# EAGLE schematic line_kick (EAGLE 9.5.1)
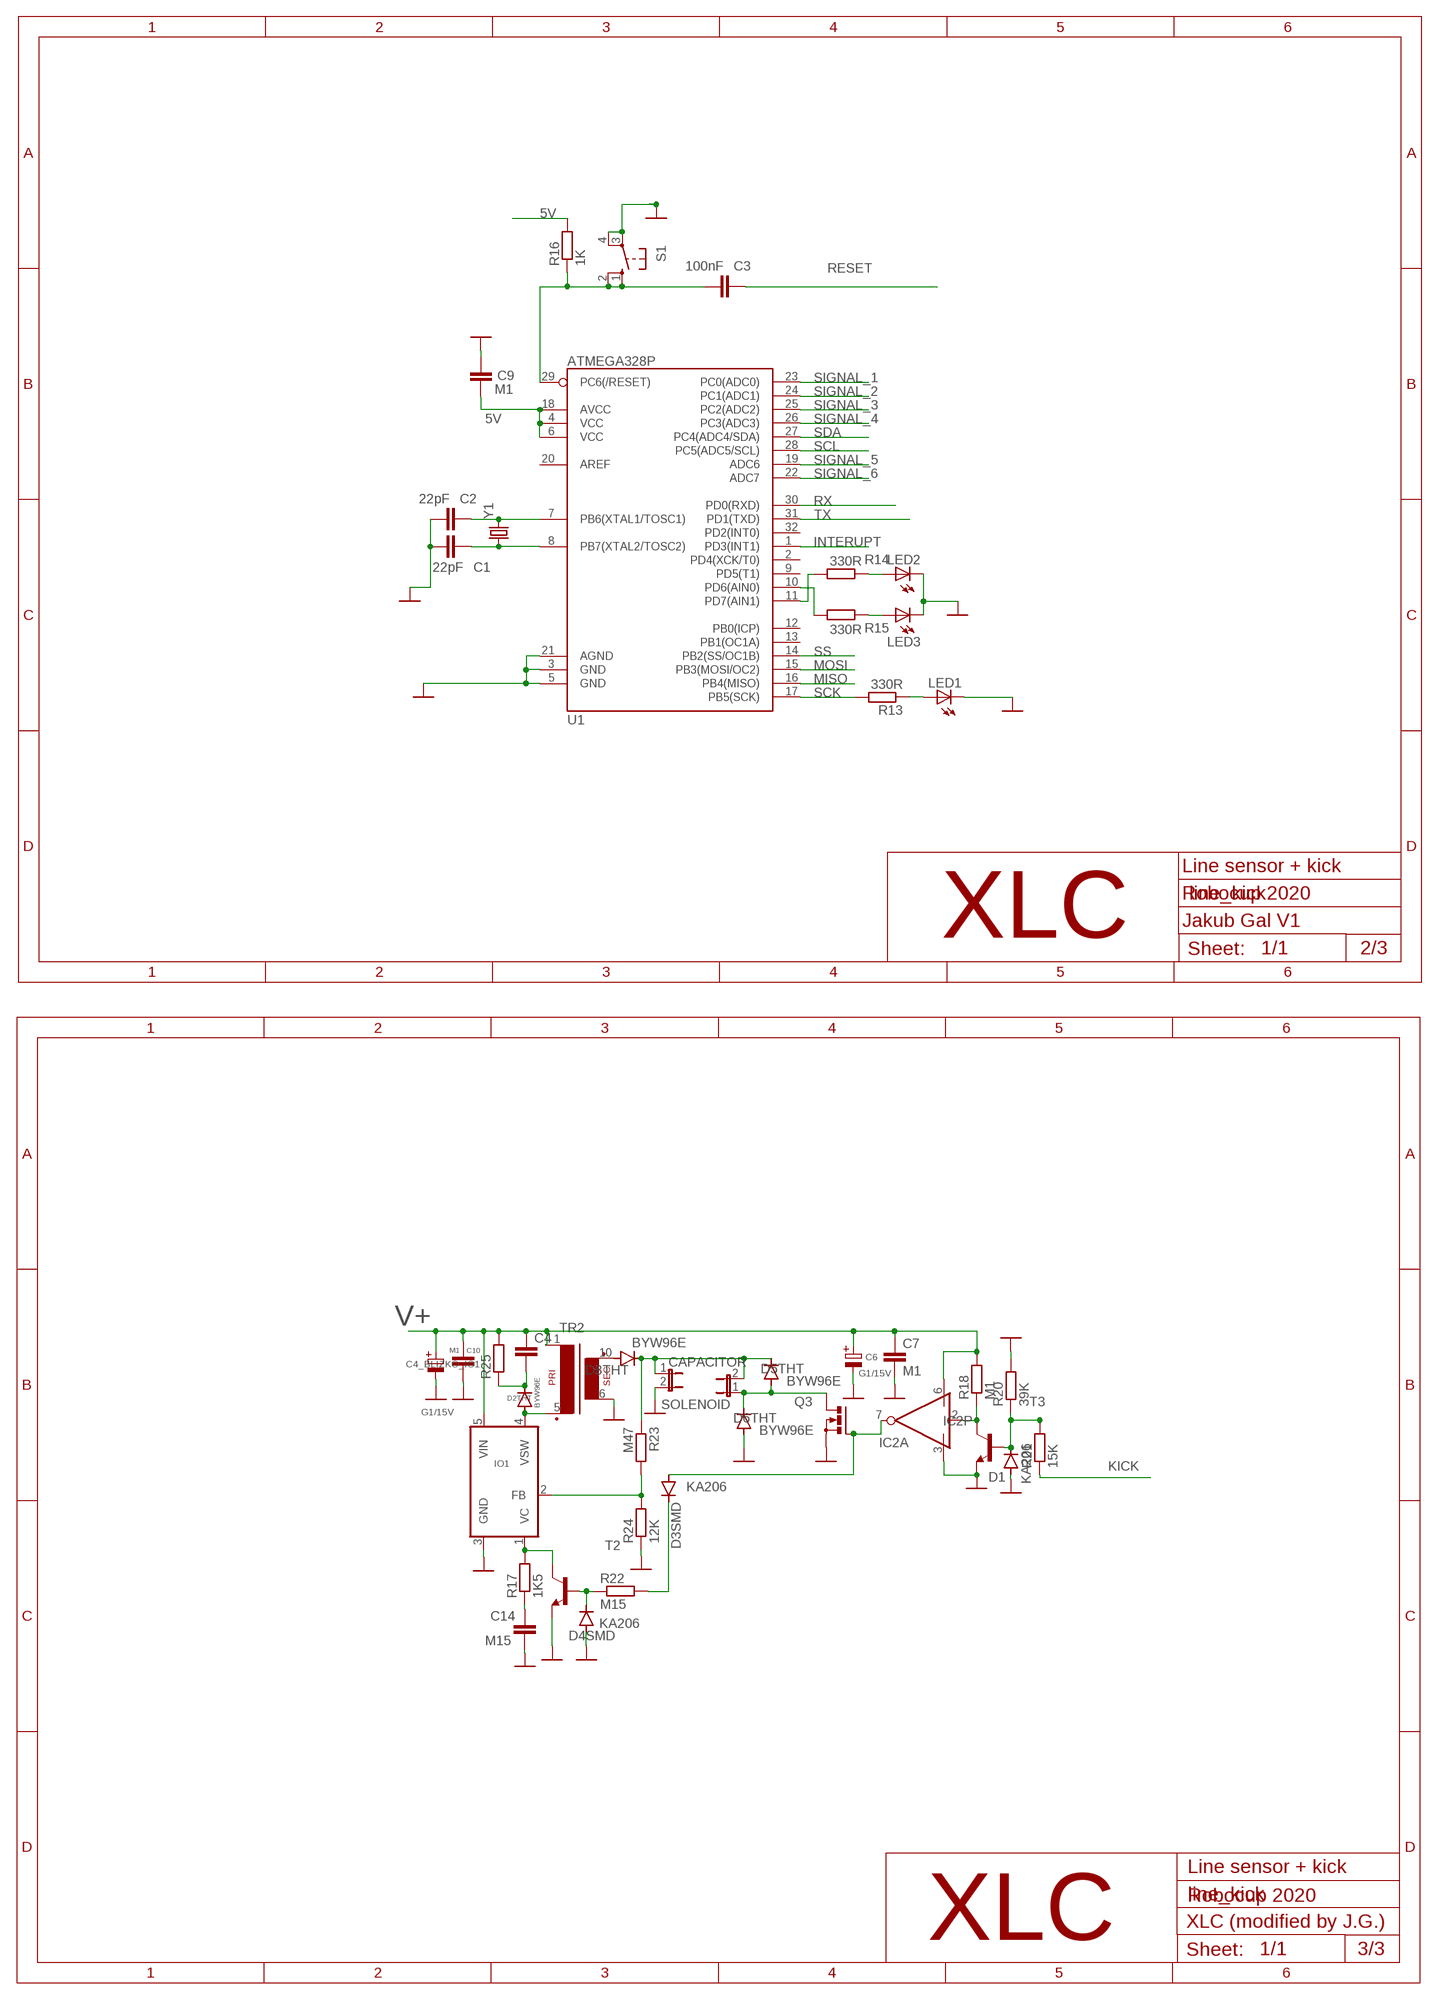
[diagram p0: schematic, sheet 1, part 1 of 2]
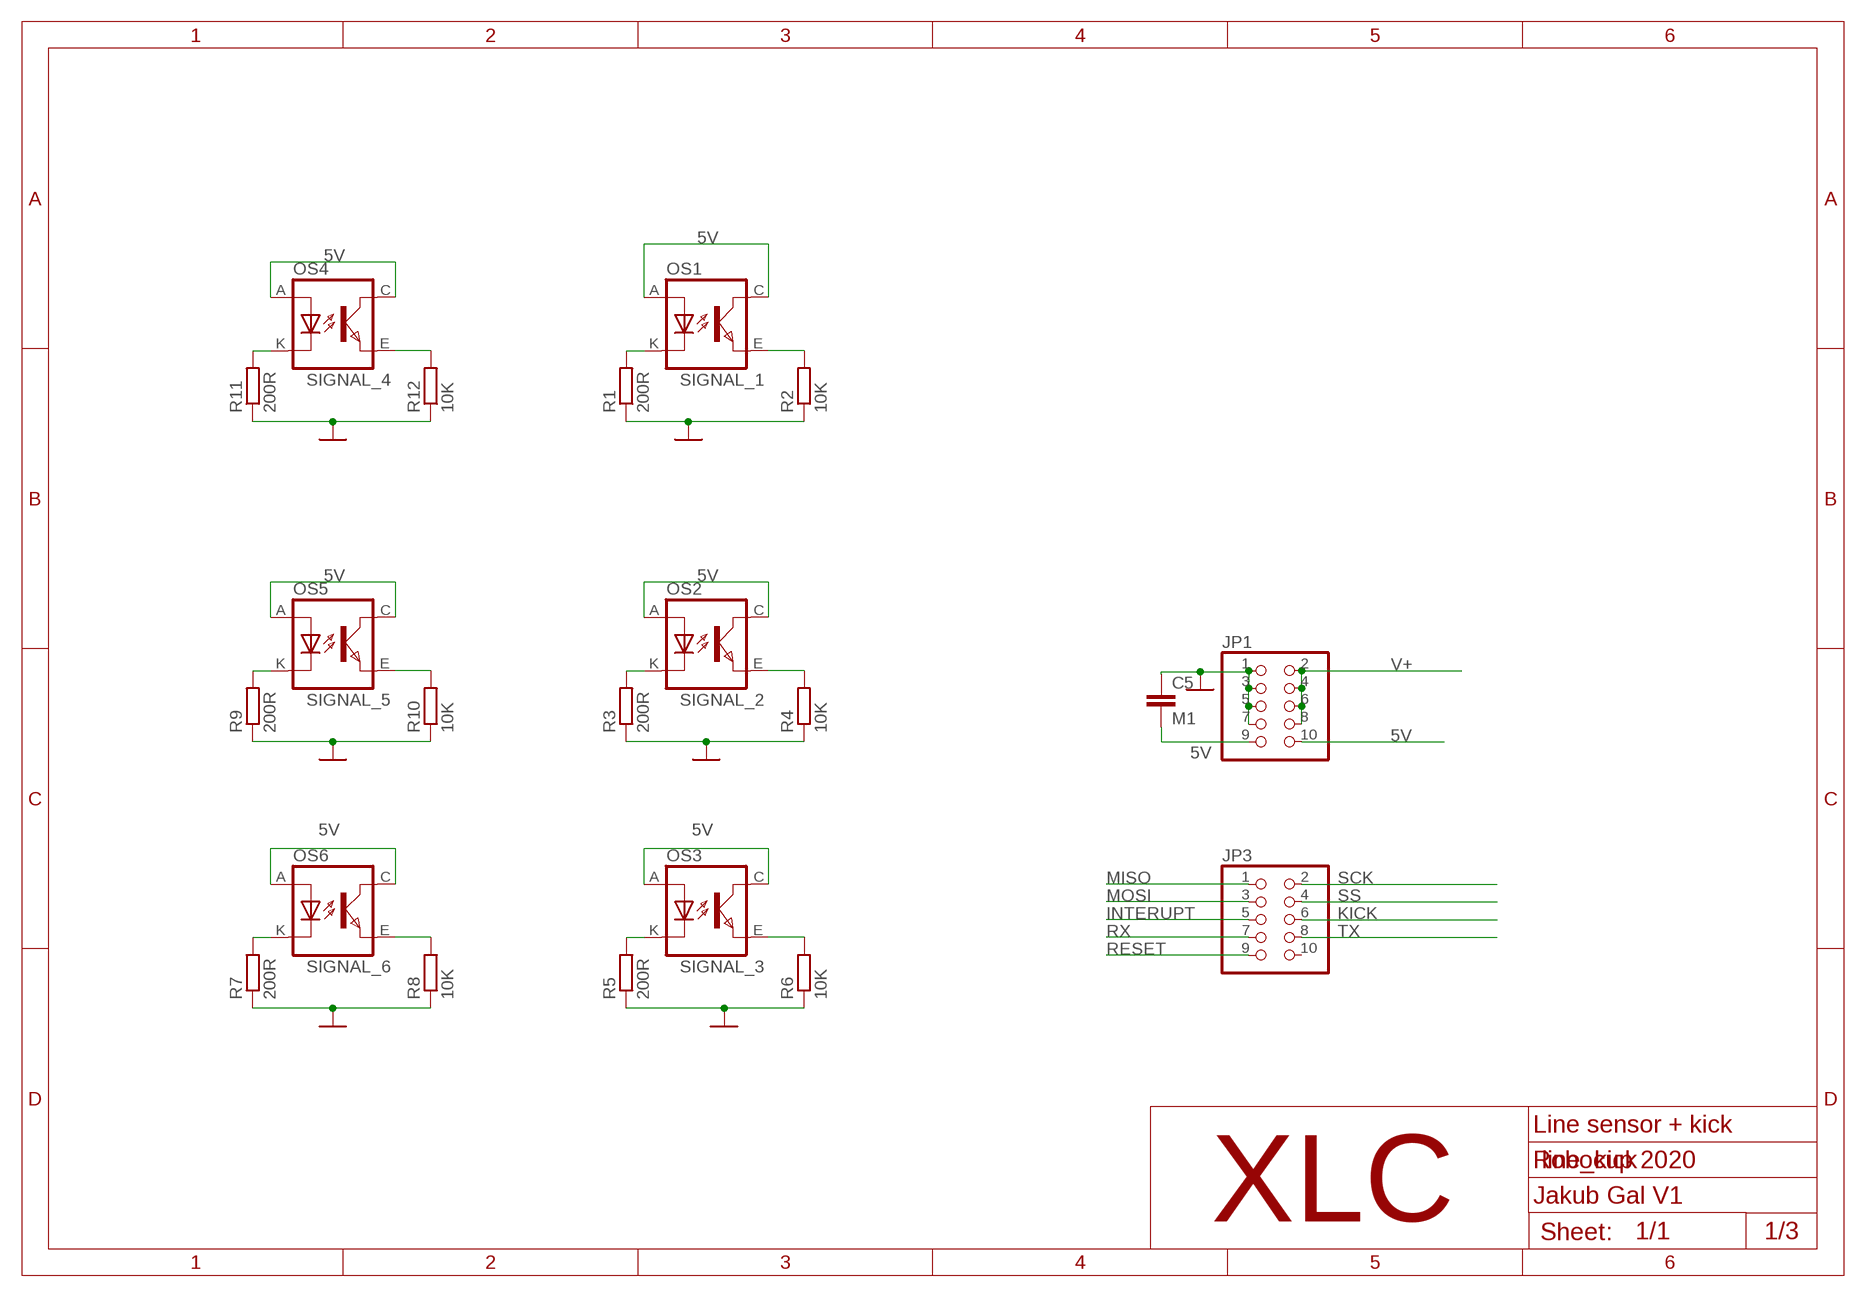
[diagram p1: schematic, sheet 1, part 2 of 2]

## Parts
C1  22pF  C-EUC0603  [C0603]
C2  22pF  C-EUC0603  [C0603]
C3  100nF  C-EUC0603  [C0603]
C4  C-EU075-052X106  [C075-052X106]
C4_BLIZKO_IO1  G1/15V  KOND-ELEKT-2,5/7  [E-2,5/7-RAD]
C5  M1  C-EUC0603  [C0603]
C6  G1/15V  KOND-ELEKT-2,5/7  [E-2,5/7-RAD]
C7  M1  C-EUC0805K  [C0805K]
C9  M1  C-EUC0603  [C0603]
C10  M1  C-EUC0805K  [C0805K]
C14  M15  C-EUC0805K  [C0805K]
CAPACITOR  JP1E  [JP1]
D1  KA206  DIODE-D-7.5  [D-7.5]
D2THT  BYW96E  BYW96  [SOD64-10]
D3SMD  KA206  DIODE-D-7.5  [D-7.5]
D4SMD  KA206  DIODE-D-7.5  [D-7.5]
D5THT  BYW96E  BYW96  [SOD64-10]
D6THT  BYW96E  BYW96  [SOD64-10]
D8THT  BYW96E  BYW96  [SOD64-10]
IC2  MIC4423BM  [SO08]
IO1  LT1071V  [TO220-5P]
JP1  PINHD-2X5IDC  [2X05_IDC]
JP3  PINHD-2X5IDC  [2X05_IDC]
LED1  LEDCHIPLED_0603  [CHIPLED_0603]
LED2  LEDCHIPLED_0603  [CHIPLED_0603]
LED3  LEDCHIPLED_0603  [CHIPLED_0603]
OS1  TCRT5000  [TCRT5000]
OS2  TCRT5000  [TCRT5000]
OS3  TCRT5000  [TCRT5000]
OS4  TCRT5000  [TCRT5000]
OS5  TCRT5000  [TCRT5000]
OS6  TCRT5000  [TCRT5000]
Q3  PMOSFET_NTO220BV  [TO220BV]
R1  200R  R-EU_R0603  [R0603]
R2  10K  R-EU_R0603  [R0603]
R3  200R  R-EU_R0603  [R0603]
R4  10K  R-EU_R0603  [R0603]
R5  200R  R-EU_R0603  [R0603]
R6  10K  R-EU_R0603  [R0603]
R7  200R  R-EU_R0603  [R0603]
R8  10K  R-EU_R0603  [R0603]
R9  200R  R-EU_R0603  [R0603]
R10  10K  R-EU_R0603  [R0603]
R11  200R  R-EU_R0603  [R0603]
R12  10K  R-EU_R0603  [R0603]
R13  330R  R-EU_R0603  [R0603]
R14  330R  R-EU_R0603  [R0603]
R15  330R  R-EU_R0603  [R0603]
R16  1K  R-EU_R0603  [R0603]
R17  1K5  R-EU_R1206  [R1206]
R18  M1  R-EU_R1206  [R1206]
R20  39K  R-EU_R1206  [R1206]
R21  15K  R-EU_R1206  [R1206]
R22  M15  R-EU_R1206  [R1206]
R23  M47  R-EU_R1206  [R1206]
R24  12K  R-EU_R1206  [R1206]
R25  REZISTOR-7,5MM-HORIZ  [R-7,5H]
S1  10-XX  [B3F-10XX]
SOLENOID  JP1E  [JP1]
T2  -NPN-SC59-BEC  [SC59-BEC]
T3  -NPN-SC59-BEC  [SC59-BEC]
TR2  TRAFO-E10-R""  [TRAFO-EE17X20]
U1  ATMEGA328P  ATMEGA328_SMT  [TQFP32-08]
Y1  CRYSTALHC49US  [HC49US]

## Nets
5V: C5.2 C9.1 JP1.9 JP1.10 OS1.A(ANODE) OS1.C(COLLECTOR) OS2.A(ANODE) OS2.C(COLLECTOR) OS3.A(ANODE) OS3.C(COLLECTOR) OS4.A(ANODE) OS4.C(COLLECTOR) OS5.A(ANODE) OS5.C(COLLECTOR) OS6.A(ANODE) OS6.C(COLLECTOR) R16.2 U1.4(VCC) U1.6(VCC) U1.18(AVCC)
GND: C1.1 C2.1 C4_BLIZKO_IO1.- C5.1 C6.- C7.2 C9.2 C10.2 C14.2 CAPACITOR.2 D1.A D4SMD.A D6THT.A IC2.3(P:GND) IO1.3(GND) JP1.1 JP1.3 JP1.5 JP1.7 LED1.C LED2.C LED3.C Q3.S R1.1 R2.1 R3.1 R4.1 R5.1 R6.1 R7.1 R8.1 R9.1 R10.1 R11.1 R12.1 R20.2 R24.1 S1.3(P) S1.4(P1) T2.E T3.E TR2.6 U1.3(GND) U1.5(GND) U1.21(AGND)
INTERUPT: JP3.5 U1.1(PD3(INT1))
KICK: JP3.6 R21.1
MISO: JP3.1 U1.16(PB4(MISO))
MOSI: JP3.3 U1.15(PB3(MOSI/OC2))
N$1: OS1.K(CATHODE) R1.2
N$2: OS2.K(CATHODE) R3.2
N$3: OS3.K(CATHODE) R5.2
N$4: OS6.K(CATHODE) R7.2
N$5: OS5.K(CATHODE) R9.2
N$6: OS4.K(CATHODE) R11.2
N$7: C2.2 U1.7(PB6(XTAL1/TOSC1)) Y1.2
N$8: C1.2 U1.8(PB7(XTAL2/TOSC2)) Y1.1
N$9: IO1.1(VC) R17.2 T2.C
N$10: C14.1 R17.1
N$11: D8THT.A TR2.10
N$12: D3SMD.A IC2.7(A:OUT) Q3.G
N$13: CAPACITOR.1 D5THT.C D8THT.C R23.1 SOLENOID.2
N$14: IO1.2(FB) R23.2 R24.2
N$15: D4SMD.C R22.1 T2.B
N$16: C3.1 R16.1 S1.1(S) S1.2(S1) U1.29(PC6(/RESET))
N$17: LED1.A R13.1
N$18: IC2.2(A:IN) R18.1 T3.C
N$19: LED2.A R14.1
N$20: R15.2 U1.10(PD6(AIN0))
N$21: LED3.A R15.1
N$22: R14.2 U1.11(PD7(AIN1))
N$23: D2THT.A IO1.4(VSW) TR2.5
N$24: C4.2 D2THT.C R25.1
N$26: D5THT.A D6THT.C Q3.D SOLENOID.1
N$29: D3SMD.C R22.2
N$31: D1.C R20.1 R21.2 T3.B
RESET: C3.2 JP3.9
RX: JP3.7 U1.30(PD0(RXD))
SCK: JP3.2 R13.2 U1.17(PB5(SCK))
SCL: U1.28(PC5(ADC5/SCL))
SDA: U1.27(PC4(ADC4/SDA))
SIGNAL_1: OS1.E(EMITTER) R2.2 U1.23(PC0(ADC0))
SIGNAL_2: OS2.E(EMITTER) R4.2 U1.24(PC1(ADC1))
SIGNAL_3: OS3.E(EMITTER) R6.2 U1.25(PC2(ADC2))
SIGNAL_4: OS4.E(EMITTER) R12.2 U1.26(PC3(ADC3))
SIGNAL_5: OS5.E(EMITTER) R10.2 U1.19(ADC6)
SIGNAL_6: OS6.E(EMITTER) R8.2 U1.22(ADC7)
SS: JP3.4 U1.14(PB2(SS/OC1B))
TX: JP3.8 U1.31(PD1(TXD))
V+: C4.1 C4_BLIZKO_IO1.+ C6.+ C7.1 C10.1 IC2.6(P:V+) IO1.5(VIN) JP1.2 JP1.4 JP1.6 JP1.8 R18.2 R25.2 TR2.1
Unconnected: IC2.4(B:IN) IC2.5(B:OUT) JP3.10 U1.2(PD4(XCK/T0)) U1.9(PD5(T1)) U1.12(PB0(ICP)) U1.13(PB1(OC1A)) U1.20(AREF) U1.32(PD2(INT0))

## Notes on the sheet
- Line sensor + kick
- Robocup 2020
- Jakub Gal V1
- XLC
- 2/3
- Line sensor + kick
- Robocup 2020
- XLC (modified by J.G.)
- XLC
- 3/3
- Line sensor + kick
- Robocup 2020
- Jakub Gal V1
- XLC
- 1/3

## Library data of the parts
C1-C3 C9 = rcl:C-EU: CAPACITOR, European symbol
C4 C5 = rcl:C-EU: CAPACITOR, European symbol; SPICEPREFIX: C
C4_BLIZKO_IO1 C6 = TABOR K1:KOND-ELEKT: Kondenzátor elektrolyticky
C7 C10 C14 = resistor:C-EU: CAPACITOR, European symbol
CAPACITOR SOLENOID = jumper:JP1E: JUMPER
D1 D3SMD D4SMD = diode:DIODE-: DIODE
D2THT D5THT D6THT D8THT = diode:BYW96: DIODE fast soft-recovery rectifier
IC2 = TABOR K1:MIC4423B: 2x Invertor driver MOSFET
IO1 = TABOR K1:LT1071: DC/DC pulzny IO
JP1 JP3 = pinhead-1:PINHD-2X5: PIN HEADER
LED1-LED3 = audio amplifier example:LED
OS1-OS3 OS5 = tcrt5000:TCRT5000
OS4 OS6 = tcrt5000:TCRT5000; SPICEPREFIX: O
Q3 = transistor-power:PMOSFET_N: Power MOSFET N-Channel
R1-R18 R20-R24 = rcl:R-EU_: RESISTOR, European symbol; SPICEPREFIX: R
R25 = TABOR K1:REZISTOR: REZISTOR
S1 = switch-omron:10-XX: OMRON SWITCH; MPN: B3F-1000; OC_FARNELL: 176432; OC_NEWARK: 36M3542
T2 T3 = DC_LOAD_AU:*-NPN-: NPN Transistror BF959 corrected 2008.03.06
TR2 = TABOR K1:TRAFO-E10-R: Transformátor s feritovym jadrom EE17x20: 1x primár, 1x sekundár
U1 = SparkFun-DigitalIC:ATMEGA328_SMT: 32-Pin Atmega328 part Commonly used on Arduino compatible boards Available in QFP and QFN packages TQFP is IC-09069 QFN is non-stock; PROD_ID: IC-09069
Y1 = SparkFun-FreqCtrl:CRYSTAL: Various standard crystals. Proven footprints. Spark Fun Electronics SKU : COM-00534